# EAGLE design mbox-001 (EAGLE 9.6.2)
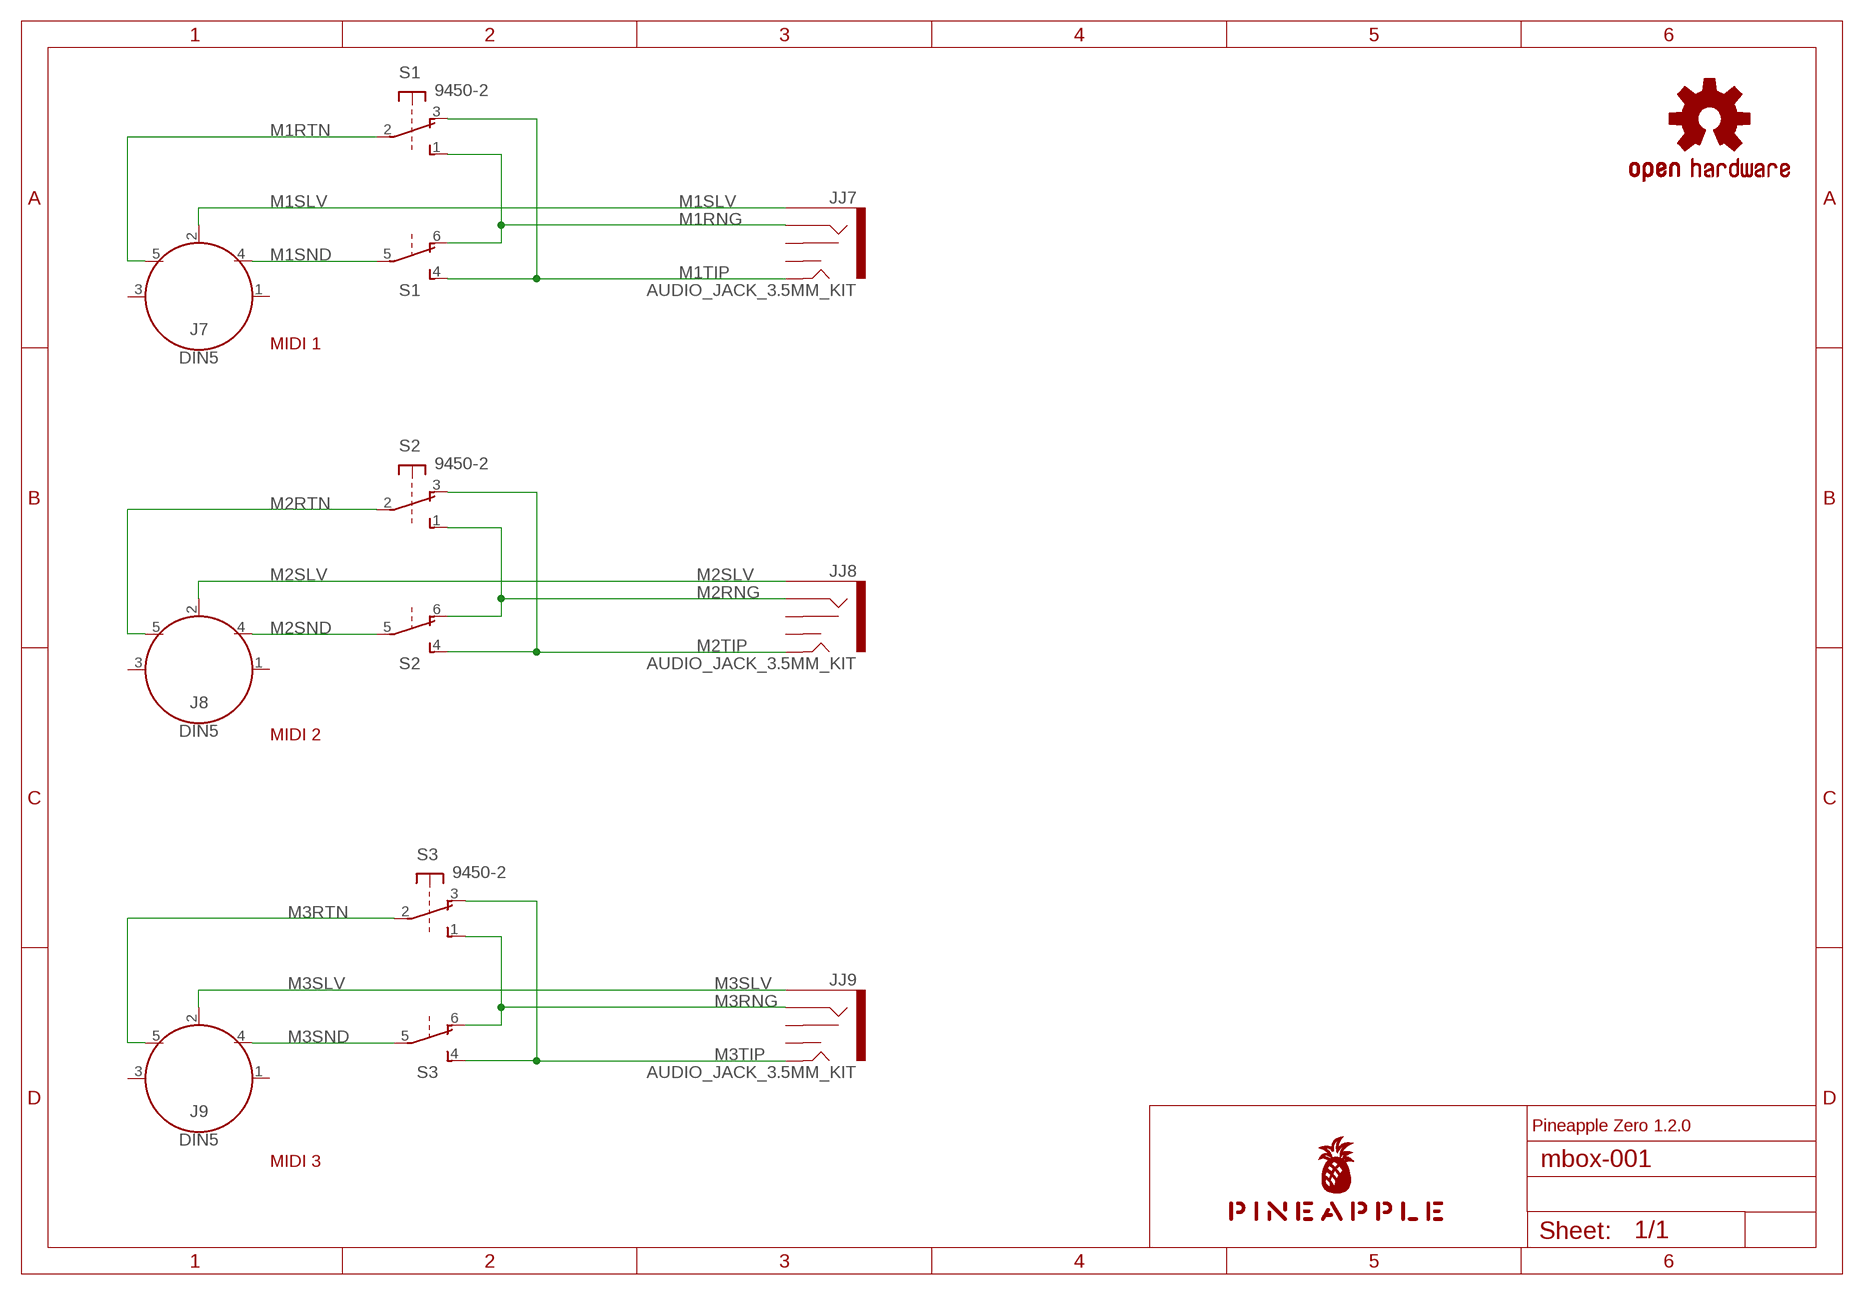
[diagram p0: schematic, sheet 1]

## Parts
J7  DIN5  [DIN5-RA-PTH]
J8  DIN5  [DIN5-RA-PTH]
J9  DIN5  [DIN5-RA-PTH]
JJ7  AUDIO_JACK_3.5MM_KIT  [AUDIO-JACK-KIT]
JJ8  AUDIO_JACK_3.5MM_KIT  [AUDIO-JACK-KIT]
JJ9  AUDIO_JACK_3.5MM_KIT  [AUDIO-JACK-KIT]
LOGO1  OSHW-LOGOS-COPPER  [OSHW-LOGO-S_COPPER]
S1  9450-2  [9450-2]
S2  9450-2  [9450-2]
S3  9450-2  [9450-2]
U$1  PINEAPPLE450  [PINEAPPLE450]

## Nets
M1RNG: JJ7.RING S1.1(1:S) S1.6(2:O)
M1RTN: J7.5 S1.2(1:P)
M1SLV [gnd]: J7.2 JJ7.SLEEVE
M1SND: J7.4 S1.5(2:P)
M1TIP: JJ7.TIP S1.3(1:O) S1.4(2:S)
M2RNG: JJ8.RING S2.1(1:S) S2.6(2:O)
M2RTN: J8.5 S2.2(1:P)
M2SLV [gnd]: J8.2 JJ8.SLEEVE
M2SND: J8.4 S2.5(2:P)
M2TIP: JJ8.TIP S2.3(1:O) S2.4(2:S)
M3RNG: JJ9.RING S3.1(1:S) S3.6(2:O)
M3RTN: J9.5 S3.2(1:P)
M3SLV [gnd]: J9.2 JJ9.SLEEVE
M3SND: J9.4 S3.5(2:P)
M3TIP: JJ9.TIP S3.3(1:O) S3.4(2:S)
Unconnected: J7.1 J7.3 J8.1 J8.3 J9.1 J9.3 JJ7.RSH JJ7.TSH JJ8.RSH JJ8.TSH JJ9.RSH JJ9.TSH

## Notes on the sheet
- MIDI 1
- MIDI 2
- Pineapple Zero 1.2.0
- MIDI 3

## Library data of the parts
J7-J9 = SparkFun-Connectors:DIN5: DIN5 Connector - Female Right Angle (frequently used as a MIDI Jack connector) This type of connector and cable is frequently used for transmitting midi data (musical instrument digital interface). It is what you usually see on a keyboard or set of electronic drums. Learn more here <https://en.wikipedia.org/wiki/MIDI>. For more information on the pinout and electrical specifications of MIDI communications, please see the following resource: https://www.midi.org/specifications/item/midi-din-electrical-specification Here is the connector we sell at SparkFun: MIDI Connector - Female Right Angle <https://www.sparkfun.com/products/9536> (PRT-09536) Datasheet <hhttp://www.sparkfun.com/datasheets/Prototyping/Connectors/MIDI-RA.pdf> It is used on this SparkFun product: SparkFun MIDI Shield <https://www.sparkfun.com/products/12898> (DEV-12898); PROD_ID: CONN-09481
JJ7-JJ9 = SparkFun-Connectors:AUDIO_JACK_3.5MM: Audio Jack 3.5mm variants of PTH and SMT stereo audio jack with bypass switches. SparkFun Products: SparkFun SparkPunk Sound Kit <[https://www.sparkfun.com/products/11177]> - PTH MP3 Trigger <https://www.sparkfun.com/products/13720> -3.5mm SMD SparkFun PicoBoard <https://www.sparkfun.com/products/11888>- 2.5mm SMD; PROD_ID: CONN-08774; SF_ID: PRT-08032
LOGO1 = SparkFun-Aesthetics:OSHW-LOGO: Open-Source Hardware (OSHW) Logo This logo indicates the piece of hardware it is found on incorporates a OSHW license and/or adheres to the definition of open source hardware found here: http://freedomdefined.org/OSHW
S1-S3 = switch-misc:9450-2: MARQUARDT SWITCH
U$1 = pineapple:PINEAPPLE450

## Net classes
0 default: width 0.152 mm, drill 0.152 mm, clearance 0.152 mm
1 pwr: width 0.305 mm, drill 0.152 mm, clearance 0.152 mm
2 gnd: width 0.305 mm, drill 0.152 mm, clearance 0.152 mm

## Board
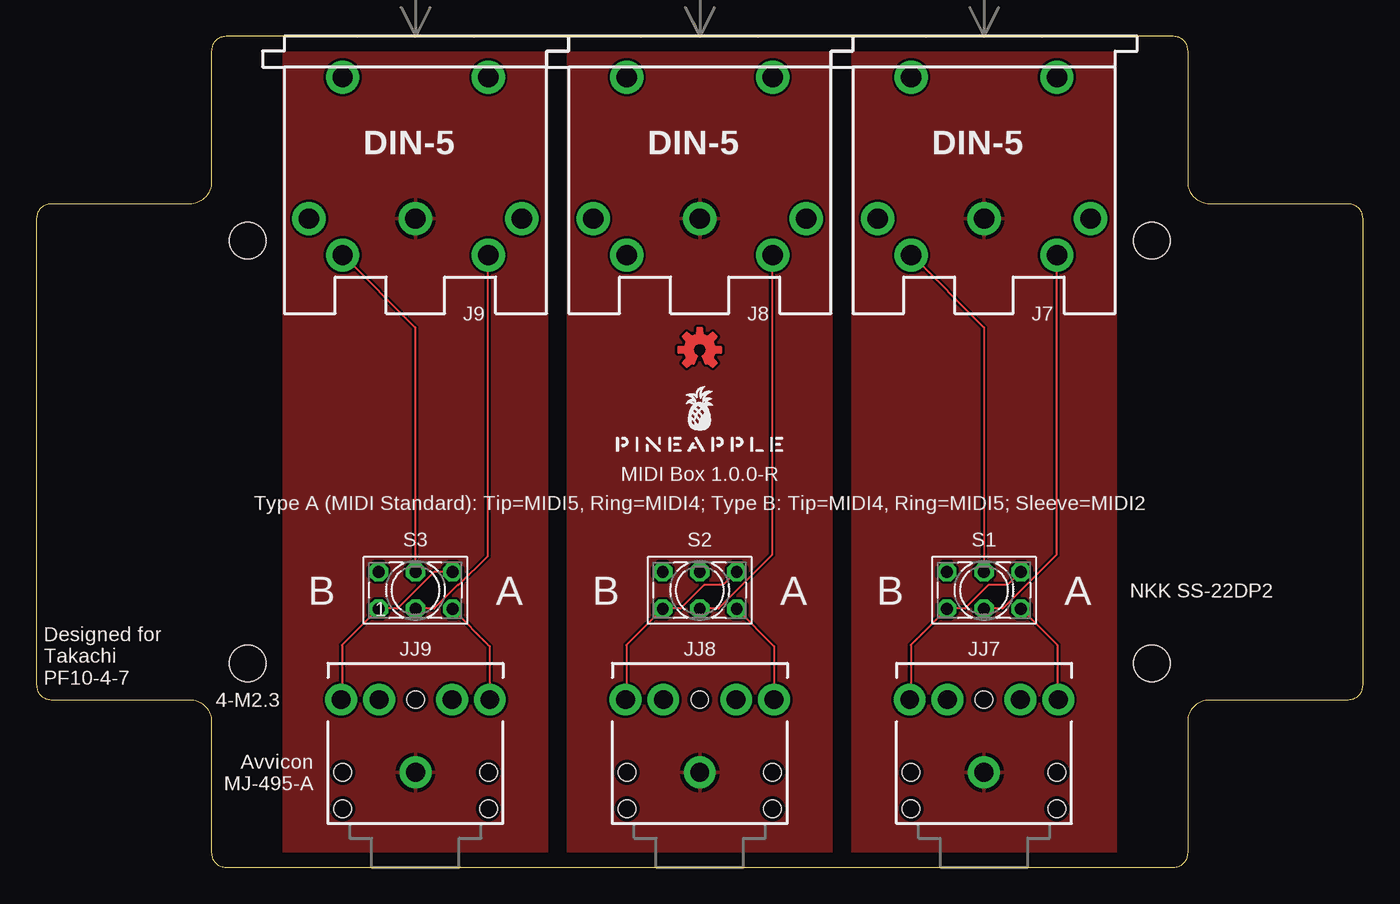
[diagram p1: board, top side]
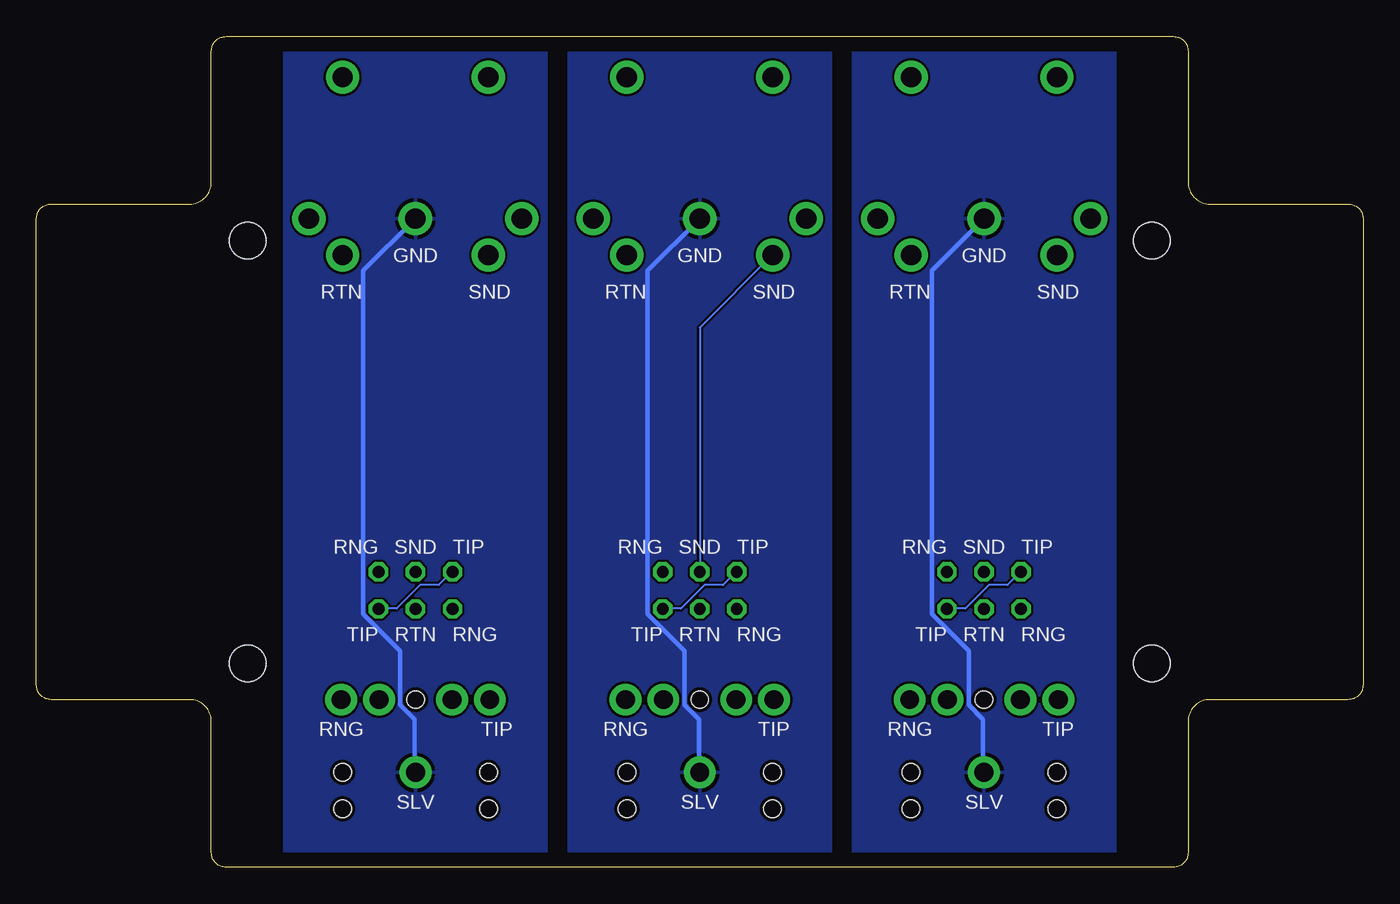
[diagram p2: board, bottom side, seen from below]

Size 91 x 57 mm. Coordinates in mm from the lower left corner, seen from the top.
Outline: 1,11.5 10.5,11.5 arc-90 12,10 12,1 arc90 13,0 78,0 arc90 79,1 79,10 arc-90 80.5,11.5 90,11.5 arc90 91,12.5 91,44.5 arc90 90,45.5 80.5,45.5 arc-90 79,47 79,56 arc90 78,57 13,57 arc90 12,56 12,47 arc-90 10.5,45.5 1,45.5 arc90 0,44.5 0,12.5 arc90 1,11.5
Copper layers (1*16): Top 0.035mm / dielectric 1.5mm / Bottom 0.035mm
Design rules "SeeedStudio_2layer_DRU_no_angle_20140221": minimum track width 6mil, minimum drill 12mil, track to track 6mil, track to pad 6mil, pad to pad 6mil, via to via 6mil, smd to smd 0mil, copper to edge 10mil, drill to drill 10mil, minimum pad ring 10mil, minimum via ring 6mil, stop-mask expansion 2mil, vias tented up to drill 100mil, thermal gap 10mil
Holes 2.5 mm at 14.5,14 76.5,14 76.5,43 14.5,43
tRestrict: area 0,11.5 to 1,45.5; area 0,44.5 to 13,45.5; area 12,44.5 to 13,57; area 12,56 to 79,57; area 78,44.5 to 79,57; area 78,44.5 to 91,45.5; area 90,11.5 to 91,45.5; area 78,11.5 to 91,12.5; area 78,0 to 79,12.5; area 12,0 to 79,1; area 12,0 to 13,12.5; area 0,11.5 to 13,12.5; 4 more areas
bRestrict: area 12,56 to 79,57; area 90,11.5 to 91,45.5; area 12,0 to 79,1; area 0,11.5 to 1,45.5; area 12.5,12 to 16.5,16; area 12,44.5 to 13,57; area 78,44.5 to 79,57; area 12,0 to 13,12.5; area 78,0 to 79,12.5; area 0,44.5 to 13,45.5; area 0,11.5 to 13,12.5; area 78,11.5 to 91,12.5; 4 more areas

### Footprints (pad centres in the part's own frame; a part is rotated, then mirrored left to right if it is on the bottom)
DIN5-RA-PTH = drill 1.4 pad 2.286: 1 7.3,12.5; 2 0,12.5; 3 -7.3,12.5; 4 5,15; 5 -5,15; 6 -5,2.8; 7 5,2.8
AUDIO-JACK-KIT = drill 1.3 pad 2.184: RING 5,5.1; RSH 5,2.5; SLEEVE 0,0; TIP 5,-5.1; TSH 5,-2.5 | hole 1.2: 0,5; -2.5,5; -2.5,-5; 0,-5; 5,0
9450-2 = drill 0.813 octagon: 1 -2.54,-1.27; 2 0,-1.27; 3 2.54,-1.27; 4 -2.54,1.27; 5 0,1.27; 6 2.54,1.27

### Placement (x,y rotation side)
J7  65,57 180 top
J8  45.5,57 180 top
J9  26,57 180 top
JJ7  65,6.5 90 top
JJ8  45.5,6.5 90 top
JJ9  26,6.5 90 top
LOGO1  45.5,35.5 0 top
S1  65,19 0 top
S2  45.5,19 0 top
S3  26,19 0 top
U$1  45.5,28.5 0 top

### Tracks (layer width: path | path; a pad name or v marks a point on that pad's centre or on a via)
M1RNG
  Top 0.152: S1.6 67.51,20.27 66.6,19.36 65.3,19.36 63.7,17.75 62.48,17.75 S1.1 62.41,17.68 59.97,15.24 59.97,11.51 JJ7.RING
M1RTN
  Top 0.152: S1.2 65.08,17.75 66.29,17.75 69.95,21.41 69.95,41.99 J7.5
M1SLV
  Bottom 0.305: JJ7.SLEEVE 65.08,6.55 65.08,10.13 66.06,11.12 66.06,14.86 68.58,17.37 68.58,40.92 65.08,44.42 J7.2
  pour Top: 56,58 74,58 74,-1 56,-1
  pour Bottom: 56,59 74,59 74,-2 56,-2 56,-1.5
M1SND
  Top 0.152: S1.5 65,20.34 65,37.03 60.05,41.99 J7.4
M1TIP
  Top 0.152: JJ7.TIP 70.03,11.51 70.03,15.24 67.59,17.68 S1.3
  Bottom 0.152: S1.3 67.51,17.75 66.29,17.75 64.69,19.36 63.4,19.36 62.48,20.27 S1.4
M2RNG
  Top 0.152: S2.6 48.01,20.27 47.09,19.36 45.8,19.36 44.2,17.75 42.98,17.75 S2.1 42.9,17.68 40.46,15.24 40.46,11.51 JJ8.RING
M2RTN
  Top 0.152: S2.2 45.57,17.75 46.79,17.75 50.44,21.41 50.44,41.99 J8.5
M2SLV
  Bottom 0.305: JJ8.SLEEVE 45.57,6.55 45.57,10.13 46.56,11.12 46.56,14.86 49.07,17.37 49.07,40.92 45.57,44.42 J8.2
  pour Top: 36.5,58 54.5,58 54.5,-1 36.5,-1
  pour Bottom: 36.5,59 54.5,59 54.5,-2 36.5,-2
M2SND
  Bottom 0.152: S2.5 45.49,20.34 45.49,37.03 40.54,41.99 J8.4
M2TIP
  Top 0.152: JJ8.TIP 50.6,15.16 48.08,17.68 S2.3
  Bottom 0.152: S2.3 48.01,17.75 46.79,17.75 45.19,19.36 43.89,19.36 42.98,20.27 S2.4
M3RNG
  Top 0.152: S3.6 28.5,20.27 27.28,20.27 24.77,17.75 23.47,17.75 S3.1 23.39,17.68 20.95,15.24 20.95,11.51 JJ9.RING
M3RTN
  Top 0.152: S3.2 26.06,17.75 27.28,17.75 28.88,19.36 28.96,19.36 30.94,21.34 30.94,41.99 J9.5
M3SLV
  Bottom 0.305: JJ9.SLEEVE 26.06,6.55 26.06,10.13 27.05,11.12 27.05,14.86 29.57,17.37 29.57,40.92 26.06,44.42 J9.2
  pour Top: 35,58 35,-1 17.5,-1 17,-1 17,58
  pour Bottom: 35,59 35,-2 17,-2 17,59
M3SND
  Top 0.152: S3.5 25.98,20.34 25.98,37.03 21.03,41.99 J9.4
M3TIP
  Top 0.152: JJ9.TIP 31.09,15.16 28.57,17.68 S3.3
  Bottom 0.152: S3.3 28.5,17.75 27.28,17.75 25.68,19.36 24.38,19.36 S3.4

### Text on the board
tNames: MIDI Box 1.0.0-R | Type A (MIDI Standard): Tip=MIDI5, Ring=MIDI4; Type B: Tip=MIDI4, Ring=MIDI5; Sleeve=MIDI2 | B | A | B | A | B | A | NKK SS-22DP2 | 1 | Designed for / Takachi / PF10-4-7 | 4-M2.3 | Avvicon / MJ-495-A
bNames: GND | GND | GND | SND | RTN | SND | RTN | SND | RTN | TIP | SND | RNG | TIP | SND | RNG | TIP | SND | RNG | RNG | RTN | TIP | RNG | RTN | TIP | RNG | RTN | TIP | TIP | RNG | TIP | RNG | TIP | RNG | SLV | SLV | SLV